# EAGLE schematic Module_MCU_ESP32Embed (EAGLE 9.6.2)
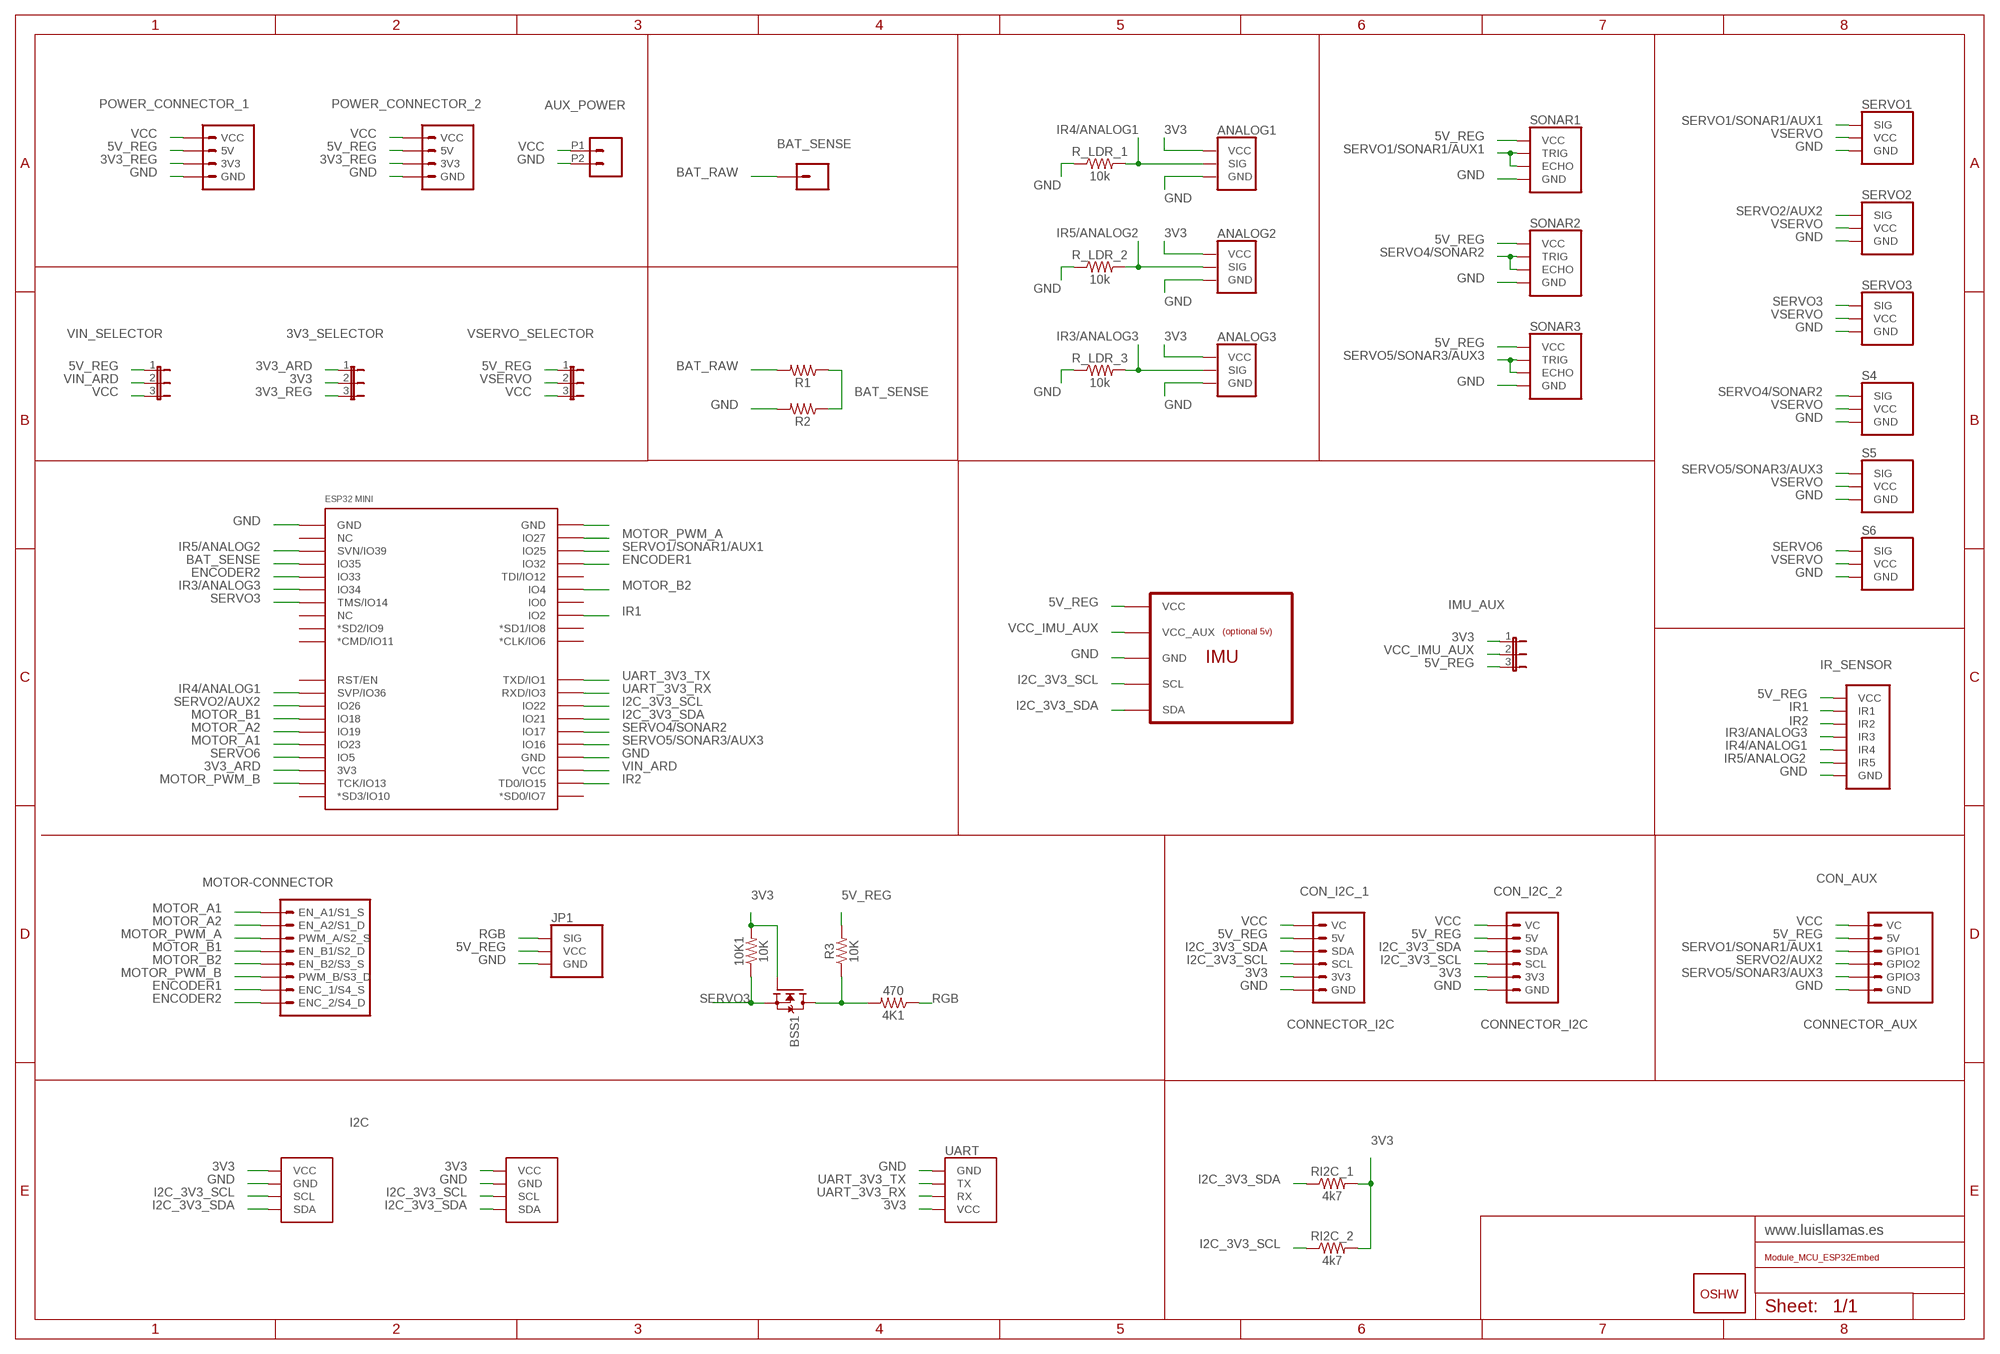
[diagram p0: schematic, sheet 1]

## Parts
3V3_SELECTOR  JUMPER_3  [JUMPER_3]
4K1  470  RESISTOR0805  [0805]
10K1  10K  RESISTOR0805  [0805]
ANALOG1  LDR/OCT  [LDR]
ANALOG2  LDR/OCT  [LDR]
ANALOG3  LDR/OCT  [LDR]
AUX_POWER  CONN_022.54MM_SCREWTERM  [1X02_2.54_SCREWTERM]
BAT_SENSE  CONN_01  [1X01]
BSS1  MOSFET-N-SOT23  [SOT23]
CON_AUX  CONNECTOR_AUX  [CONNECTOR_AUX]
CON_I2C_1  CONNECTOR_I2C  [CONNECTOR_I2C]
CON_I2C_2  CONNECTOR_I2C  [CONNECTOR_I2C]
GOLD_ORB_SM1  OSHWLOGO_GOLD_ORB_MED  [OSHW1]
I2C_1  I2C  GENERIC_I2CVCC_GND_SCL_SDA  [I2C_VCC_GND_SCL_SDA]
I2C_2  GENERIC_I2CVCC_GND_SCL_SDA  [I2C_VCC_GND_SCL_SDA]
IMU_AUX  JUMPER_3  [JUMPER_3]
IR_SENSOR  IR-5/OCT  [IR-5]
JP1  SERVOSERVO  [SERVO]
MOTOR_CONNECTOR  MOTOR-CONNECTOR  [MOTOR-CONNECTOR]
POWER_CONNECTOR_1  POWER-CONNECTOR  [POWER-CONNECTOR]
POWER_CONNECTOR_2  POWER-CONNECTOR  [POWER-CONNECTOR]
R1  RESISTOR1206  [1206]
R2  RESISTOR1206  [1206]
R3  10K  RESISTOR0805  [0805]
R_LDR_1  10k  RESISTOR1206  [1206]
R_LDR_2  10k  RESISTOR1206  [1206]
R_LDR_3  10k  RESISTOR1206  [1206]
RI2C_1  4k7  RESISTOR1206  [1206]
RI2C_2  4k7  RESISTOR1206  [1206]
S4  SERVOSERVO  [SERVO]
S5  SERVOSERVO  [SERVO]
S6  SERVOSERVO  [SERVO]
SERVO1  SERVOSERVO  [SERVO]
SERVO2  SERVOSERVO  [SERVO]
SERVO3  SERVOSERVO  [SERVO]
SONAR1  ULTRASONIC/OCT  [ULTRASONIC]
SONAR2  ULTRASONIC/OCT  [ULTRASONIC]
SONAR3  ULTRASONIC/OCT  [ULTRASONIC]
U1  IMU_6/9/10DOFMPU6050  [IMU_6/9/10DOF]
U$5  ESP32-WEMOS  [ESP32-WEMOS]
UART  UART  GENERIC_UARTGND_TX_RX_VCC  [GENERIC_UART]
VIN_SELECTOR  JUMPER_3  [JUMPER_3]
VSERVO_SELECTOR  JUMPER_3  [JUMPER_3]

## Nets
3V3: 3V3_SELECTOR.2 10K1.2 ANALOG1.VCC ANALOG2.VCC ANALOG3.VCC BSS1.1(G) CON_I2C_1.3V3 CON_I2C_2.3V3 I2C_1.VCC I2C_2.VCC IMU_AUX.1 RI2C_1.2 RI2C_2.2 UART.VCC
3V3_ARD: 3V3_SELECTOR.1 U$5.3V3
3V3_REG: 3V3_SELECTOR.3 POWER_CONNECTOR_1.3V3 POWER_CONNECTOR_2.3V3
5V_REG: CON_AUX.5V CON_I2C_1.5V CON_I2C_2.5V IMU_AUX.3 IR_SENSOR.VCC JP1.VCC POWER_CONNECTOR_1.5V POWER_CONNECTOR_2.5V R3.2 SONAR1.VCC SONAR2.VCC SONAR3.VCC U1.VCC VIN_SELECTOR.1 VSERVO_SELECTOR.1
BAT_RAW: BAT_SENSE.1 R1.2
BAT_SENSE: R1.1 R2.1 U$5.IO35
ENCODER1: MOTOR_CONNECTOR.ENC_1/S4_S U$5.IO32
ENCODER2: MOTOR_CONNECTOR.ENC_2/S4_D U$5.IO33
GND: ANALOG1.GND ANALOG2.GND ANALOG3.GND AUX_POWER.P2 CON_AUX.GND CON_I2C_1.GND CON_I2C_2.GND I2C_1.GND I2C_2.GND IR_SENSOR.GND JP1.GND POWER_CONNECTOR_1.GND POWER_CONNECTOR_2.GND R2.2 R_LDR_1.1 R_LDR_2.1 R_LDR_3.1 S4.GND S5.GND S6.GND SERVO1.GND SERVO2.GND SERVO3.GND SONAR1.GND SONAR2.GND SONAR3.GND U1.GND U$5.GND@1(GND) U$5.GND@3(GND) UART.GND
I2C_3V3_SCL: CON_I2C_1.SCL CON_I2C_2.SCL I2C_1.SCL I2C_2.SCL RI2C_2.1 U1.SCL U$5.IO22
I2C_3V3_SDA: CON_I2C_1.SDA CON_I2C_2.SDA I2C_1.SDA I2C_2.SDA RI2C_1.1 U1.SDA U$5.IO21
IR1: IR_SENSOR.1(IR1) U$5.IO2
IR2: IR_SENSOR.2(IR2) U$5.TD0/IO15
IR3/ANALOG3: ANALOG3.SIG IR_SENSOR.3(IR3) R_LDR_3.2 U$5.IO34
IR4/ANALOG1: ANALOG1.SIG IR_SENSOR.4(IR4) R_LDR_1.2 U$5.SVP/IO36
IR5/ANALOG2: ANALOG2.SIG IR_SENSOR.5(IR5) R_LDR_2.2 U$5.SVN/IO39
MOTOR_A1: MOTOR_CONNECTOR.EN_A1/S1_S U$5.IO23
MOTOR_A2: MOTOR_CONNECTOR.EN_A2/S1_D U$5.IO19
MOTOR_B1: MOTOR_CONNECTOR.EN_B1/S2_D U$5.IO18
MOTOR_B2: MOTOR_CONNECTOR.EN_B2/S3_S U$5.IO4
MOTOR_PWM_A: MOTOR_CONNECTOR.PWM_A/S2_S U$5.IO27
MOTOR_PWM_B: MOTOR_CONNECTOR.PWM_B/S3_D U$5.TCK/IO13
N$2: 4K1.2 BSS1.3(D) R3.1
N$32: U$5.GND@2(GND)
RGB: 4K1.1 JP1.SIG
SERVO1/SONAR1/AUX1: CON_AUX.GPIO1 SERVO1.SIG SONAR1.ECHO SONAR1.TRIG U$5.IO25
SERVO2/AUX2: CON_AUX.GPIO2 SERVO2.SIG U$5.IO26
SERVO3: 10K1.1 BSS1.2(S) SERVO3.SIG U$5.TMS/IO14
SERVO4/SONAR2: S4.SIG SONAR2.ECHO SONAR2.TRIG U$5.IO17
SERVO5/SONAR3/AUX3: CON_AUX.GPIO3 S5.SIG SONAR3.ECHO SONAR3.TRIG U$5.IO16
SERVO6: S6.SIG U$5.IO5
UART_3V3_RX: U$5.RXD/IO3 UART.RX
UART_3V3_TX: U$5.TXD/IO1 UART.TX
VCC: AUX_POWER.P1 CON_AUX.VC CON_I2C_1.VC CON_I2C_2.VC POWER_CONNECTOR_1.VCC POWER_CONNECTOR_2.VCC VIN_SELECTOR.3 VSERVO_SELECTOR.3
VCC_IMU_AUX: IMU_AUX.2 U1.VCC_AUX
VIN_ARD: U$5.VCC VIN_SELECTOR.2
VSERVO: S4.VCC S5.VCC S6.VCC SERVO1.VCC SERVO2.VCC SERVO3.VCC VSERVO_SELECTOR.2
Unconnected: U$5.CLK/IO6(*CLK/IO6) U$5.CMD/IO11(*CMD/IO11) U$5.IO0 U$5.NC@1(NC) U$5.NC@2(NC) U$5.RST/EN U$5.SD0/IO7(*SD0/IO7) U$5.SD1/IO8(*SD1/IO8) U$5.SD2/IO9(*SD2/IO9) U$5.SD3/IO10(*SD3/IO10) U$5.TDI/IO12

## Library data of the parts
3V3_SELECTOR IMU_AUX VIN_SELECTOR VSERVO_SELECTOR = LLL_Jumpers:JUMPER_3
4K1 10K1 R1-R3 R_LDR_1-R_LDR_3 RI2C_1 RI2C_2 = SparkFun-Resistors:RESISTOR: Generic Resistor Package
ANALOG1-ANALOG3 = LLL_Headers:LDR: Header for LDR
AUX_POWER = LLL_Connectors:CONN_02: Multi connection point. Often used as Generic Header-pin footprint for 0.1 inch spaced/style header connections On any of the 0.1 inch spaced packages, you can populate with these: Break Away Headers - Straight <https://www.sparkfun.com/products/116> (PRT-00116) Break Away Male Headers - Right Angle <https://www.sparkfun.com/products/553> (PRT-00553) Female Headers <https://www.sparkfun.com/products/115> (PRT-00115) Break Away Headers - Machine Pin <https://www.sparkfun.com/products/117> (PRT-00117) Break Away Female Headers - Swiss Machine Pin <https://www.sparkfun.com/products/743> (PRT-00743) For SCREWTERMINALS and SPRING TERMINALS visit here: Screw Terimnals on SparkFun.com <https://www.sparkfun.com/search/results?term=Screw+Terminals> (5mm/3.5mm/2.54mm spacing) This device is also useful as a general connection point to wire up your design to another part of your project. Our various solder wires solder well into these plated through hole pads. Hook-Up Wire - Assortment (Stranded, 22 AWG) <https://www.sparkfun.com/products/11375> (PRT-11375) Hook-Up Wire - Assortment (Solid Core, 22 AWG) <https://www.sparkfun.com/products/11367> (PRT-11367) View the entire wire category on our website here <https://www.sparkfun.com/categories/141> Special notes: Molex polarized connector foot print use with: PRT-08233 with associated crimp pins and housings. 2.54_SCREWTERM for use with PRT-10571. 3.5mm Screw Terminal footprints for PRT-08084 5mm Screw Terminal footprints for use with PRT-08432
BAT_SENSE = SparkFun-Connectors:CONN_01: Single connection point. Often used as Generic Header-pin footprint for 0.1 inch spaced/style header connections On any of the 0.1 inch spaced packages, you can populate with these: Break Away Headers - Straight <https://www.sparkfun.com/products/116> (PRT-00116) Break Away Male Headers - Right Angle <https://www.sparkfun.com/products/553> (PRT-00553) Female Headers <https://www.sparkfun.com/products/115> (PRT-00115) Break Away Headers - Machine Pin <https://www.sparkfun.com/products/117> (PRT-00117) Break Away Female Headers - Swiss Machine Pin <https://www.sparkfun.com/products/743> (PRT-00743) This device is also useful as a general connection point to wire up your design to another part of your project. Our various solder wires solder well into these plated through hole pads. Hook-Up Wire - Assortment (Stranded, 22 AWG) <https://www.sparkfun.com/products/11375> (PRT-11375) Hook-Up Wire - Assortment (Solid Core, 22 AWG) <https://www.sparkfun.com/products/11367> (PRT-11367) View the entire wire category on our website here <https://www.sparkfun.com/categories/141> Special notes: SMTSO-256-ET is a "flush mount" nut for a 4-40 screw. We mostly use this on specialty testbeds; it is a nice way to connect hardware to your PCB at an adjustable hieght. Also note, the SNAP packages are for using a snappable style connector. We sell a baggie of snaps and they are also used on two LilyPad designs: Snap Assortment - 30 pack (male and female) <https://www.sparkfun.com/products/11347> (DEV-11347) LilyPad Arduino SimpleSnap <https://www.sparkfun.com/products/10941> (DEV-10941) LilyPad SimpleSnap Protoboard <https://www.sparkfun.com/products/10940> (DEV-10940)
BSS1 = we-transistor:MOSFET-N: N-Channel MOSFET SOT23 N-Chn MOSFET TSM3404, TSM240N03 (Vgs>=+/-20V, Vds<=30V, Id>=3A + Rds<=0.05Ohm @ Vgs=4.5V) BSS138 (Vgs>=+/-20V, Vds<=40V, Id>=0.2A + Rds<=3Ohm @ Vgs=4.5V) SOT223 Low Side Switch with Protection (Infineon) BSP76 (Vin=0...10V, Vds<=42V, Id=1.4A + Rds=0.2Ohm @ Vin=5V) BSP77 (Vin=0...10V, Vds<=42V, Id=2.2A + Rds=0.1Ohm @ Vin=5V) D²Pak Low Side Switch with Protection (Infineon) BTS117TC (Vin=0...10V, Vds<=60V, Id=3.5A + Rds=0.12Ohm @ Vin=5V) BTS133TC (Vin=0...10V, Vds<=60V, Id=7A + Rds=0.06Ohm @ Vin=5V) BTS141TC (Vin=0...10V, Vds<=60V, Id=12A + Rds=0.03Ohm @ Vin=5V) BTS3018TC (Vin=0...10V, Vds<=60V, Id=6A + Rds=0.02Ohm @ Vin=5V)
CON_AUX = LLL_Connectors:CONNECTOR_AUX
CON_I2C_1 CON_I2C_2 = LLL_Connectors:CONNECTOR_I2C
GOLD_ORB_SM1 = LLL_Frames:OSHWLOGO: These are Open-Source Hardware logos.
I2C_1 I2C_2 = LLL_Headers:GENERIC_I2C
IR_SENSOR = LLL_Headers:IR-5: Header for sensor 5xIR
JP1 S4-S6 SERVO1-SERVO3 = LLL_Headers:SERVO: Header for servo
MOTOR_CONNECTOR = LLL_Motors:MOTOR-CONNECTOR: MOTOR CONNECTOR 8p DC Motor EN_A1 EN_A2 PWM_A EN_B1 EN_B2 PWM_B ENC_1 ENC_2 Stepper STEP1_S STEP1_D STEP2_S STEP2_D STEP3_S STEP3_D STEP4_S STEP4_D
POWER_CONNECTOR_1 POWER_CONNECTOR_2 = LLL_Power:POWER-CONNECTOR: JST Connector
SONAR1-SONAR3 = LLL_Headers:ULTRASONIC: Header for ultrasonic sensor
U1 = LLL_IMUs:IMU_6/9/10DOF
U$5 = LLL_ESP32:ESP32-WEMOS
UART = LLL_Headers:GENERIC_UART

## Net classes
0 default: clearance 0.205 mm